# EAGLE design Fluxos-2 (EAGLE 7.2.0)
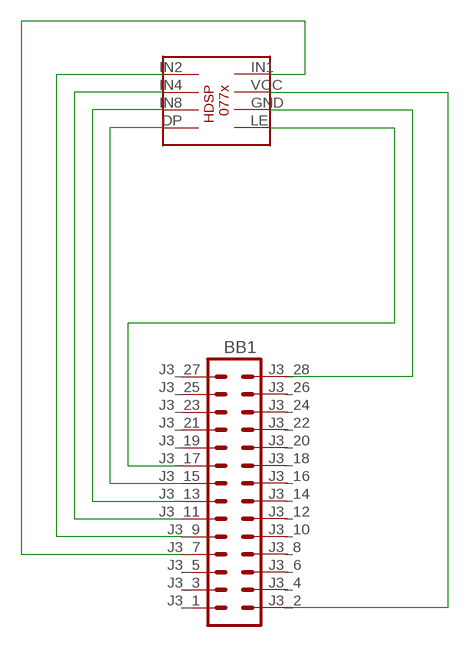
[diagram p0: schematic, sheet 1]

## Parts
BB1  BEAGLE_EXPANSION  [BEAGLE_EXPANSION]
U$1  HDSP-077X  [HDSP-077X]

## Nets
N$1: BB1.J3_11 U$1.IN4
N$2: BB1.J3_2 U$1.VCC
N$3: BB1.J3_28 U$1.GND
N$4: BB1.J3_17 U$1.LE
N$5: BB1.J3_15 U$1.DP
N$6: BB1.J3_13 U$1.IN8
N$7: BB1.J3_9 U$1.IN2
N$8: BB1.J3_7 U$1.IN1
Unconnected: BB1.J3_1 BB1.J3_3 BB1.J3_4 BB1.J3_5 BB1.J3_6 BB1.J3_8 BB1.J3_10 BB1.J3_12 BB1.J3_14 BB1.J3_16 BB1.J3_18 BB1.J3_19 BB1.J3_20 BB1.J3_21 BB1.J3_22 BB1.J3_23 BB1.J3_24 BB1.J3_25 BB1.J3_26 BB1.J3_27

## Library data of the parts
BB1 = dab5267-fluxos:BEAGLE_EXPANSION: BeagleBoard C4 Expansion Provides pinouts for J3, J4, and J5. J3 is the main expansion header. J4 is the first LCD connector. J5 is the second LCD connector.
U$1 = 7Segments:HDSP-077X

## Board
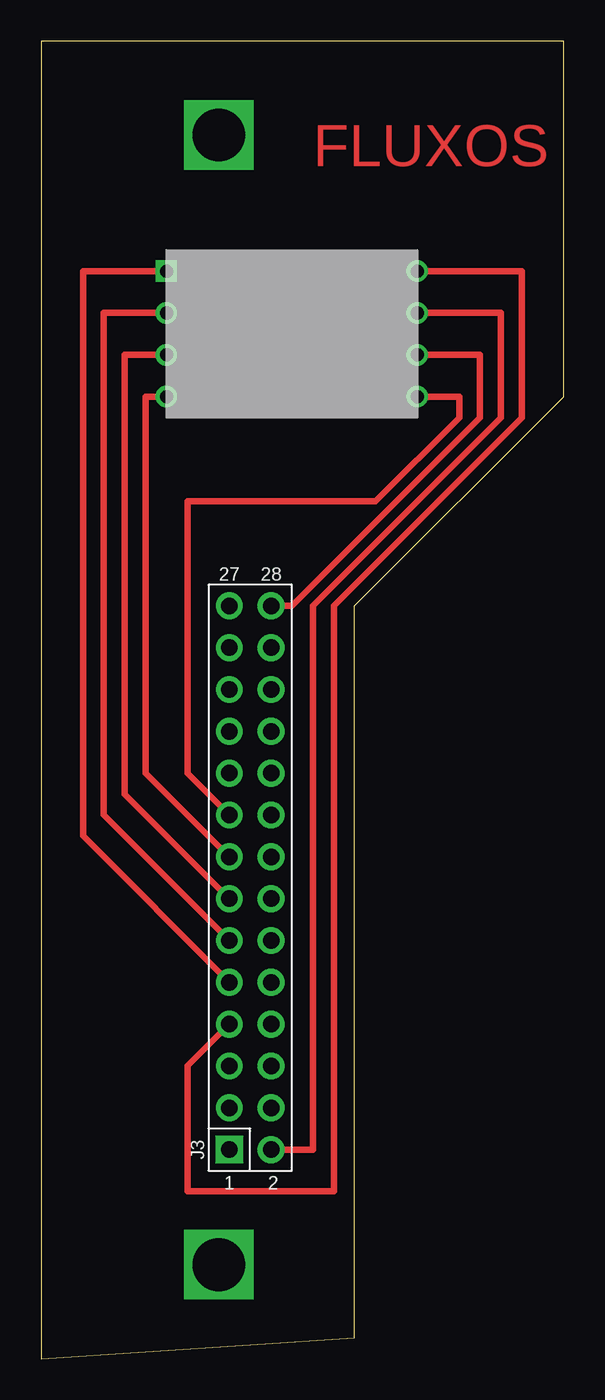
[diagram p1: board, top side]

Size 31.75 x 80 mm. Coordinates in mm from the lower left corner, seen from the top.
Outline: 0,0 19.05,1.27 19.05,45.72 31.75,58.42 31.75,80 0,80 0,0
Copper layers (1*16): Top 0.035mm / dielectric 1.5mm / Bottom 0.035mm
Design rules "default": minimum track width 10mil, minimum drill 24mil, track to track 8mil, track to pad 8mil, pad to pad 8mil, via to via 8mil, smd to smd 8mil, copper to edge 40mil, drill to drill 8mil, minimum pad ring 10mil, minimum via ring 8mil, stop-mask expansion 4mil, vias tented up to drill 0mil, thermal gap 10mil

### Footprints (pad centres in the part's own frame; a part is rotated, then mirrored left to right if it is on the bottom)
BEAGLE_EXPANSION = drill 1 pad 1.676 square: J3_1 0,0 | drill 1 pad 1.625: J3_2 2.54,0; J3_3 0,2.54; J3_4 2.54,2.54; J3_5 0,5.08; J3_6 2.54,5.08; J3_7 0,7.62; J3_8 2.54,7.62; J3_9 0,10.16; J3_10 2.54,10.16; J3_11 0,12.7; J3_12 2.54,12.7; J3_13 0,15.24; J3_14 2.54,15.24; J3_15 0,17.78; J3_16 2.54,17.78; J3_17 0,20.32; J3_18 2.54,20.32; J3_19 0,22.86; J3_20 2.54,22.86; J3_21 0,25.4; J3_22 2.54,25.4; J3_23 0,27.94; J3_24 2.54,27.94; J3_25 0,30.48; J3_26 2.54,30.48; J3_27 0,33.02; J3_28 2.54,33.02 | drill 3.2 square: P$69 -0.635,-6.985; P$72 -0.635,61.595
HDSP-077X = drill 0.8: DP 7.62,-15.24; GND 5.08,0; IN1 0,0; IN4 2.54,-15.24; IN8 5.08,-15.24; LE 7.62,0; VCC 2.54,0 | drill 0.8 square: IN2 0,-15.24

### Placement (x,y rotation side)
BB1  11.43,12.7 0 top
U$1  22.86,66.04 270 top

### Tracks (layer width: path | path; a pad name or v marks a point on that pad's centre or on a via)
N$1
  Top 0.406: U$1.IN4 3.81,63.5 3.81,33.02 BB1.J3_11
N$2
  Top 0.406: U$1.VCC 27.94,63.5 27.94,57.15 16.51,45.72 16.51,12.7 BB1.J3_2
N$3
  Top 0.406: U$1.GND 26.67,60.96 26.67,57.15 15.24,45.72 BB1.J3_28
N$4
  Top 0.406: U$1.LE 25.4,58.42 25.4,57.15 20.32,52.07 8.89,52.07 8.89,35.56 BB1.J3_17
N$5
  Top 0.406: U$1.DP 6.35,58.42 6.35,35.56 BB1.J3_15
N$6
  Top 0.406: U$1.IN8 5.08,60.96 5.08,34.29 BB1.J3_13
N$7
  Top 0.406: U$1.IN2 2.54,66.04 2.54,31.75 BB1.J3_9
N$8
  Top 0.406: U$1.IN1 29.21,66.04 29.21,57.15 17.78,45.72 17.78,10.16 8.89,10.16 8.89,17.78 BB1.J3_7

### Text on the board
Top: FLUXOS